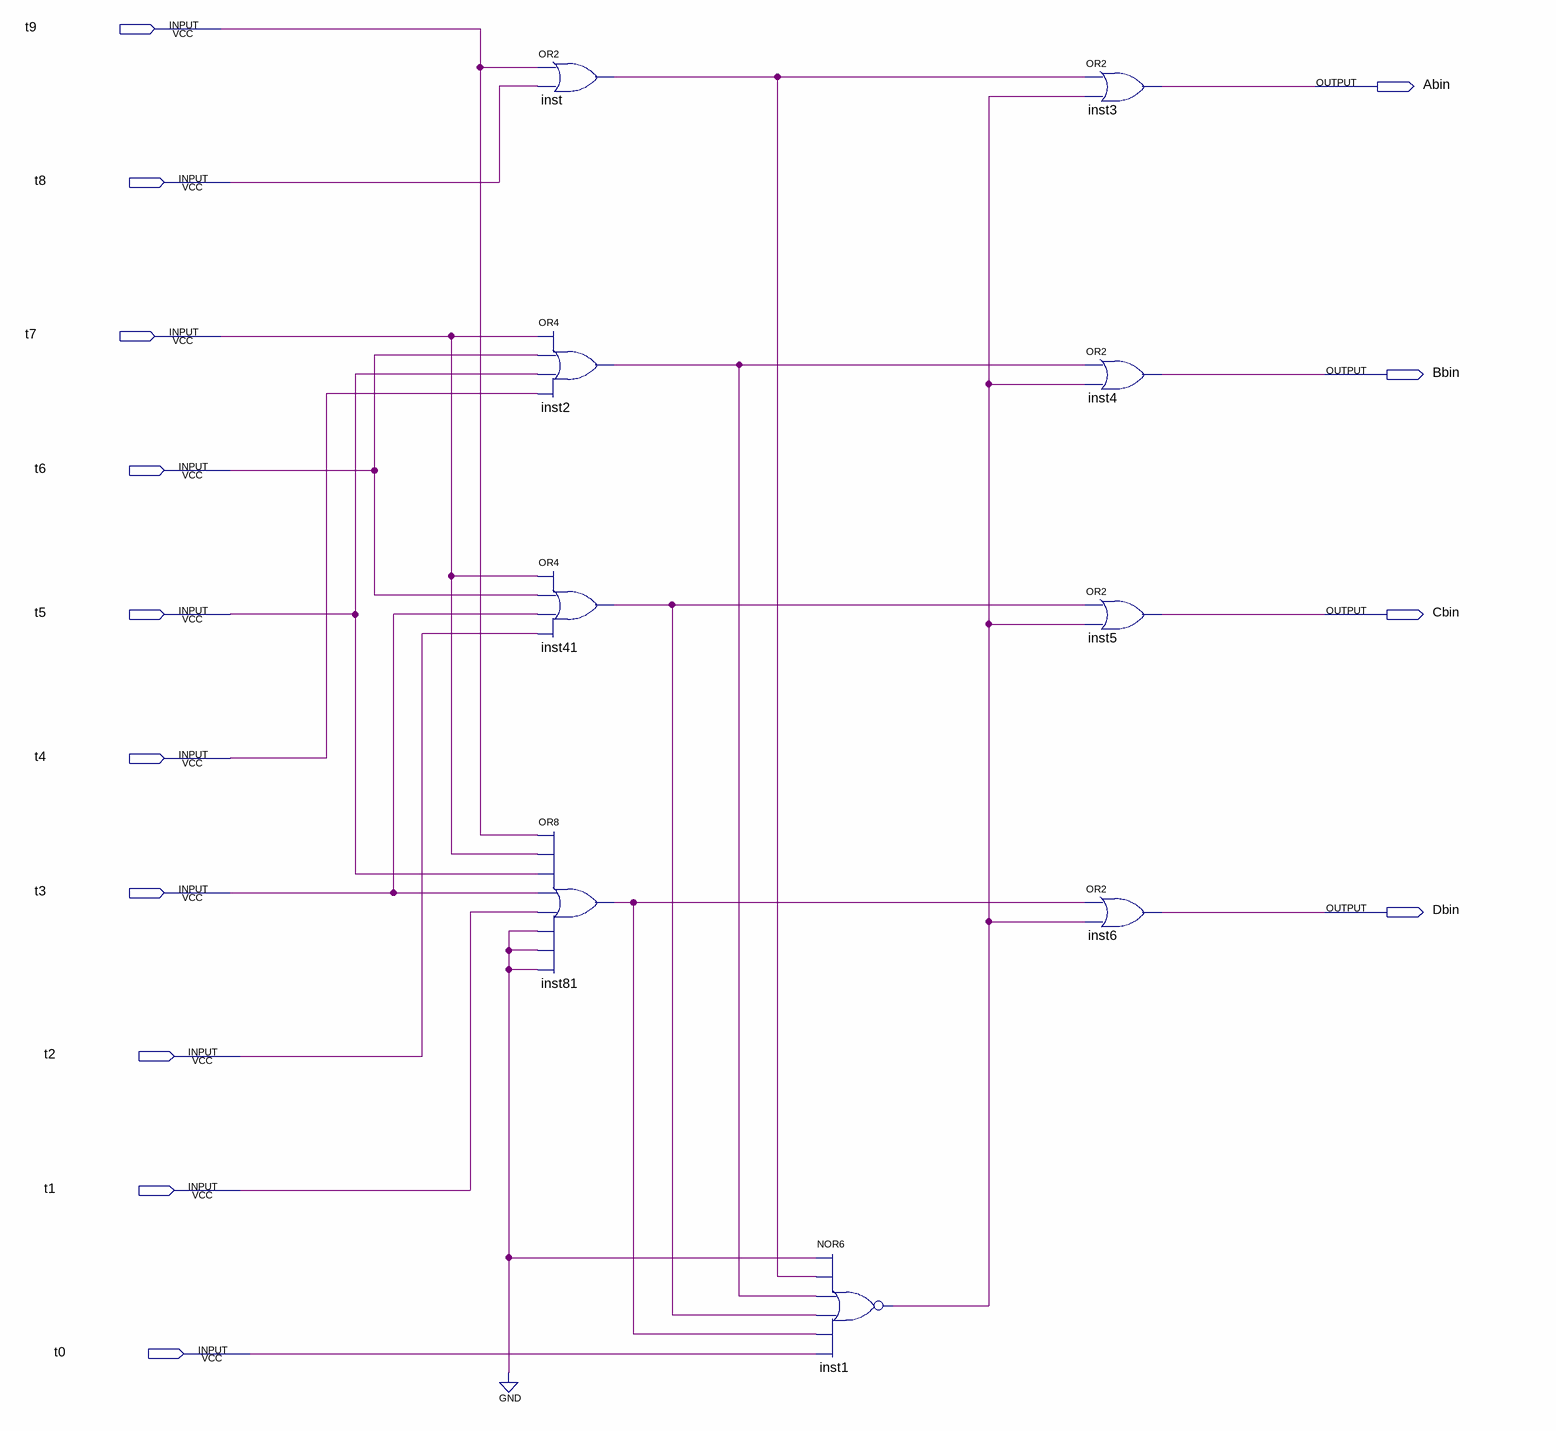
[diagram p0: schematic sheet]
// Quartus schematic DecToBinEncoder.bdf as structural Verilog: 9 symbols, 14 pins
module DecToBinEncoder (
  input  t9,
  input  t8,
  input  t7,
  input  t6,
  input  t5,
  input  t4,
  input  t3,
  input  t2,
  input  t1,
  input  t0,
  output Abin,
  output Bbin,
  output Cbin,
  output Dbin
);

  wire inst1_out, inst2_out, inst41_out, inst81_out, inst_out;

  or inst (inst_out, t9, t8);
  or inst2 (inst2_out, t7, t6, t5, t4);
  or inst41 (inst41_out, t7, t6, t3, t2);
  or inst81 (inst81_out, t9, t7, t5, t3, t1, 1'b0, 1'b0, 1'b0);
  nor inst1 (inst1_out, 1'b0, inst_out, inst2_out, inst41_out, inst81_out, t0);
  or inst3 (Abin, inst_out, inst1_out);
  or inst4 (Bbin, inst2_out, inst1_out);
  or inst5 (Cbin, inst41_out, inst1_out);
  or inst6 (Dbin, inst81_out, inst1_out);
endmodule
